# Altium schematic sheet FMC_connector.SchDoc
size A2; DocumentNumber: 3; SheetNumber: 3; SheetTotal: 30
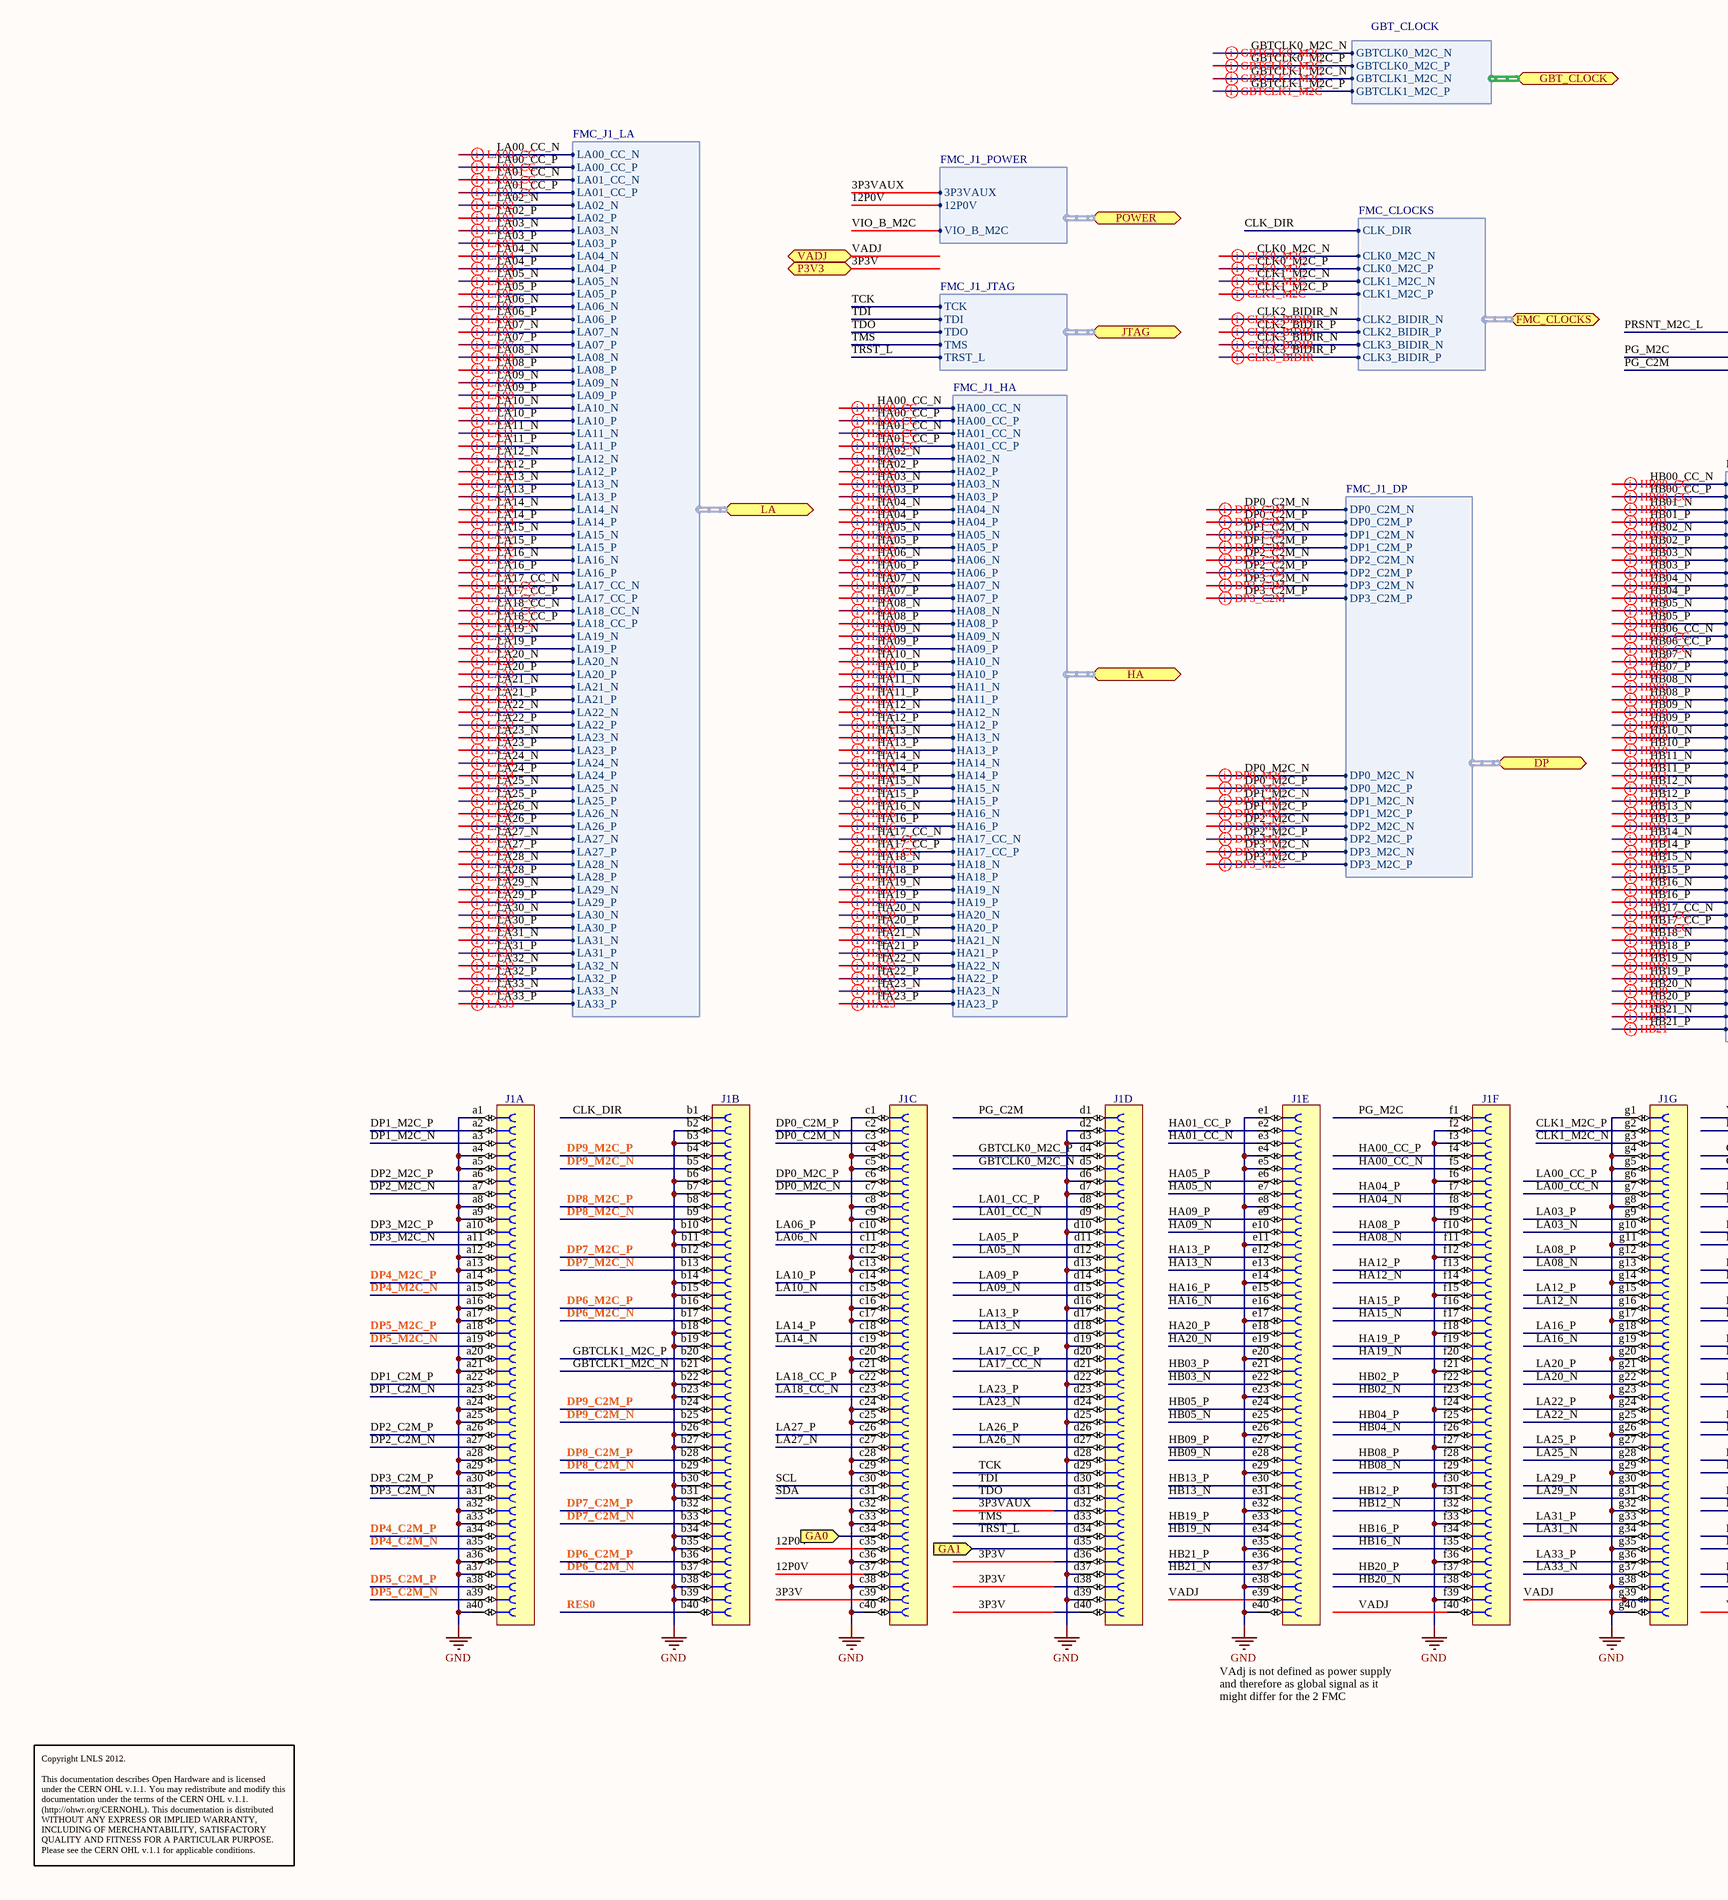
[diagram p0: FMC_connector.SchDoc, left]
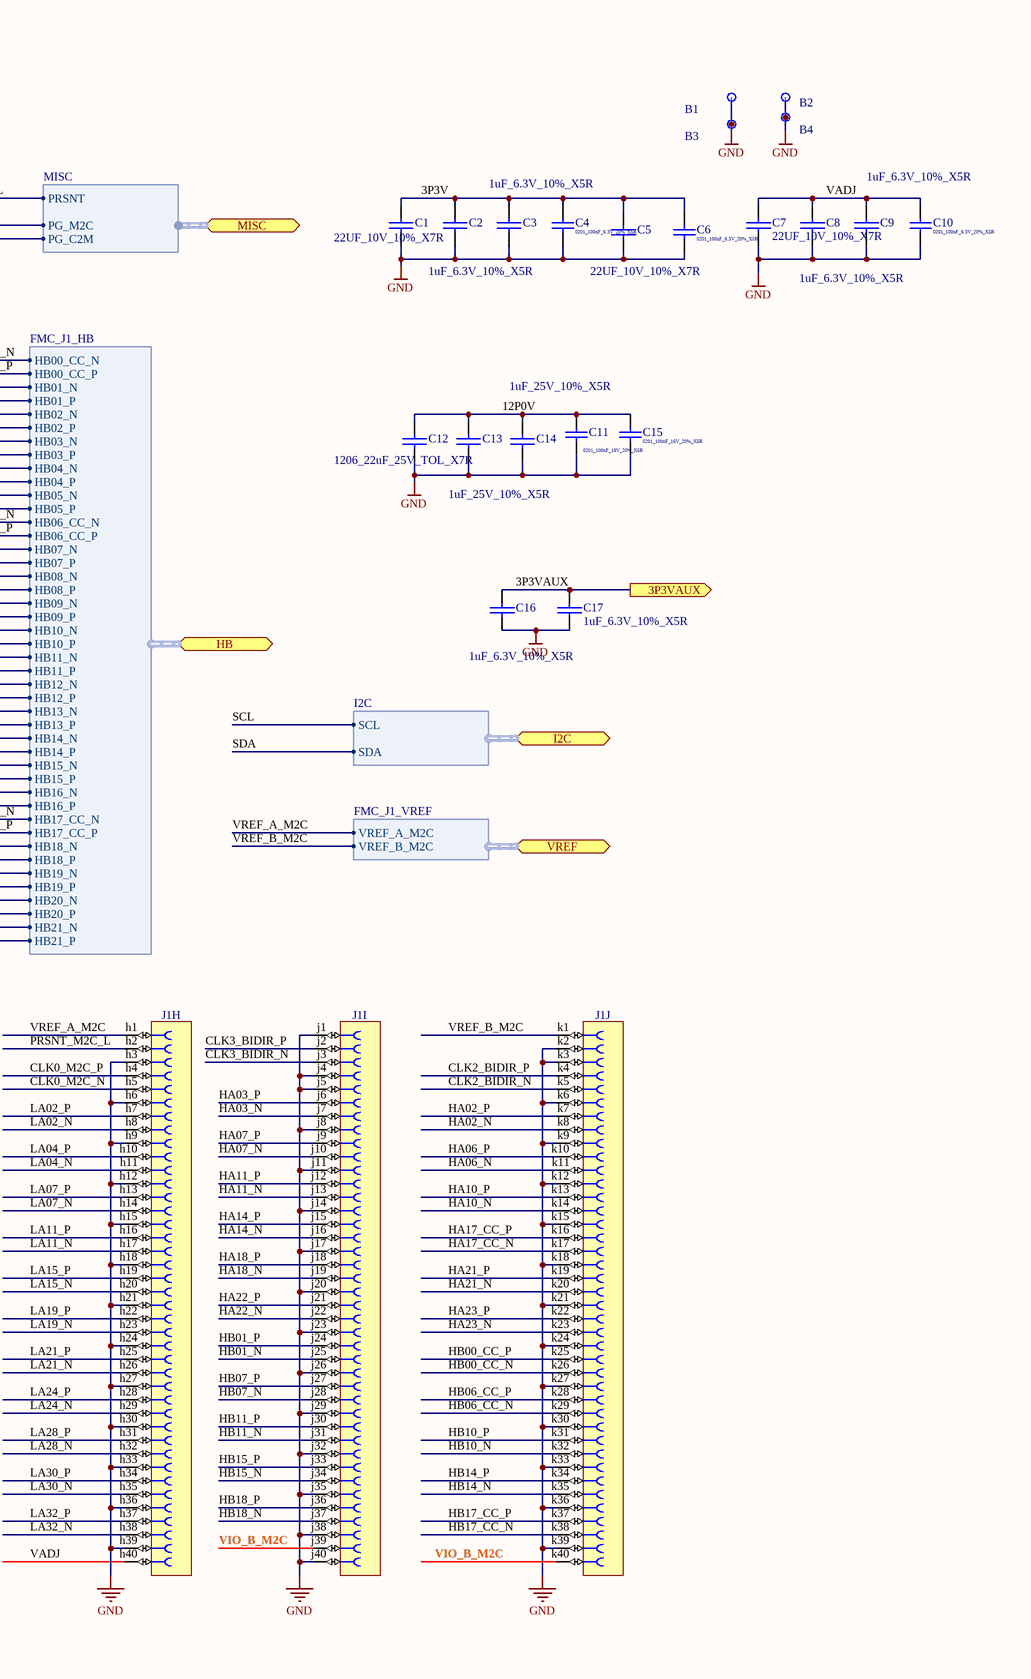
[diagram p1: FMC_connector.SchDoc, right]

## Parts
B1  Plated Hole  [MTG270_500]  (value not drawn)
B2  Plated Hole  [MTG270_500]  (value not drawn)
B3  Plated Hole  [MTG270_500]  (value not drawn)
B4  Plated Hole  [MTG270_500]  (value not drawn)
C1  22UF_10V_10%_X7R  [1206C]
C2  1uF_6.3V_10%_X5R  [0603C]
C3  1uF_6.3V_10%_X5R  [0603C]
C4  0201_100nF_6.3V_20%_X5R  [CAPC0603X33N]
C5  22UF_10V_10%_X7R  [1206C]
C6  0201_100nF_6.3V_20%_X5R  [CAPC0603X33N]
C7  22UF_10V_10%_X7R  [1206C]
C8  1uF_6.3V_10%_X5R  [0603C]
C9  1uF_6.3V_10%_X5R  [0603C]
C10  0201_100nF_6.3V_20%_X5R  [CAPC0603X33N]
C11  0201_100nF_16V_20%_X5R  [CAPC0603X33N]
C12  1206_22uF_25V_TOL_X7R  [1206C]
C13  1uF_25V_10%_X5R  [0603C]
C14  1uF_25V_10%_X5R  [0603C]
C15  0201_100nF_16V_20%_X5R  [CAPC0603X33N]
C16  1uF_6.3V_10%_X5R  [0603C]
C17  1uF_6.3V_10%_X5R  [0603C]
J1  VITA 57  [SAMTEC_ASP-134486-01]  (value not drawn)  (parts A,B,C,D,E,F,G,H,I,J of 10)

## Ports
3P3VAUX (out), DP (harness FMC_J1_DP), FMC_CLOCKS (harness FMC_CLOCKS), GA0 (in), GA1 (in), GBT_CLOCK (harness GBT_CLOCK), HA (harness FMC_J1_HA), HB (harness FMC_J1_HB), I2C (harness I2C), JTAG (harness FMC_J1_JTAG), LA (harness FMC_J1_LA), MISC (harness MISC), P3V3, POWER (harness FMC_J1_POWER), VADJ, VREF (harness FMC_J1_VREF)

## Harnesses
FMC_J1_DP: DP1_C2M_N, DP1_C2M_P, DP1_M2C_N, DP1_M2C_P, DP2_C2M_N, DP2_C2M_P, DP2_M2C_N, DP2_M2C_P, DP3_C2M_N, DP3_C2M_P, DP3_M2C_N, DP3_M2C_P, DP0_C2M_N, DP0_C2M_P, DP0_M2C_N, DP0_M2C_P
FMC_J1_LA: LA05_N, LA05_P, LA06_N, LA06_P, LA09_N, LA09_P, LA10_N, LA10_P, LA13_N, LA13_P, LA14_N, LA14_P, LA23_N, LA23_P, LA26_N, LA26_P, LA27_N, LA27_P, LA02_N, LA02_P, LA03_N, LA03_P, LA04_N, LA04_P, LA07_N, LA07_P, LA08_N, LA08_P, LA11_N, LA11_P, LA12_N, LA12_P, LA15_N, LA15_P, LA16_N, LA16_P, LA19_N, LA19_P, LA20_N, LA20_P, LA21_N, LA21_P, LA22_N, LA22_P, LA24_N, LA24_P, LA25_N, LA25_P, LA28_N, LA28_P, LA29_N, LA29_P, LA30_N, LA30_P, LA31_N, LA31_P, LA32_N, LA32_P, LA33_N, LA33_P, LA00_CC_N, LA00_CC_P, LA01_CC_N, LA01_CC_P, LA17_CC_N, LA17_CC_P, LA18_CC_N, LA18_CC_P
FMC_J1_HA: HA04_N, HA04_P, HA05_N, HA05_P, HA08_N, HA08_P, HA09_N, HA09_P, HA12_N, HA12_P, HA13_N, HA13_P, HA15_N, HA15_P, HA16_N, HA16_P, HA19_N, HA19_P, HA20_N, HA20_P, HA02_N, HA02_P, HA03_N, HA03_P, HA06_N, HA06_P, HA07_N, HA07_P, HA10_N, HA10_P, HA11_N, HA11_P, HA14_N, HA14_P, HA18_N, HA18_P, HA21_N, HA21_P, HA22_N, HA22_P, HA23_N, HA23_P, HA17_CC_N, HA17_CC_P, HA00_CC_N, HA00_CC_P, HA01_CC_N, HA01_CC_P
FMC_J1_HB: HB02_N, HB02_P, HB03_N, HB03_P, HB04_N, HB04_P, HB05_N, HB05_P, HB08_N, HB08_P, HB09_N, HB09_P, HB12_N, HB12_P, HB13_N, HB13_P, HB16_N, HB16_P, HB19_N, HB19_P, HB20_N, HB20_P, HB21_N, HB21_P, HB01_N, HB01_P, HB07_N, HB07_P, HB10_N, HB10_P, HB11_N, HB11_P, HB14_N, HB14_P, HB15_N, HB15_P, HB18_N, HB18_P, HB17_CC_N, HB17_CC_P, HB06_CC_N, HB06_CC_P, HB00_CC_N, HB00_CC_P
FMC_J1_POWER: 3P3VAUX, 12P0V, VIO_B_M2C
FMC_J1_JTAG: TCK, TDI, TDO, TMS, TRST_L
I2C: SCL, SDA
FMC_CLOCKS: CLK2_BIDIR_N, CLK2_BIDIR_P, CLK3_BIDIR_N, CLK3_BIDIR_P, CLK0_M2C_N, CLK0_M2C_P, CLK1_M2C_N, CLK1_M2C_P, CLK_DIR
FMC_J1_VREF: VREF_A_M2C, VREF_B_M2C
GBT_CLOCK: GBTCLK0_M2C_N, GBTCLK0_M2C_P, GBTCLK1_M2C_N, GBTCLK1_M2C_P
MISC: PRSNT, PG_M2C, PG_C2M

## Nets
GND: B1.1 B2.1 B3.1 B4.1 C1.2 C2.2 C3.2 C4.1 C5.2 C6.1 C7.2 C8.2 C9.2 C10.1 C11.1 C12.2 C13.2 C14.2 C15.1 C16.2 C17.2 J1.a1 J1.a4 J1.a5 J1.a8 J1.a9 J1.a12 J1.a13 J1.a16 J1.a17 J1.a20 J1.a21 J1.a24 J1.a25 J1.a28 J1.a29 J1.a32 J1.a33 J1.a36 J1.a37 J1.a40 J1.b2 J1.b3 J1.b6 J1.b7 J1.b10 J1.b11 J1.b14 J1.b15 J1.b18 J1.b19 J1.b22 J1.b23 J1.b26 J1.b27 J1.b30 J1.b31 J1.b34 J1.b35 J1.b38 J1.b39 J1.c1 J1.c4 J1.c5 J1.c8 J1.c9 J1.c12 J1.c13 J1.c16 J1.c17 J1.c20 J1.c21 J1.c24 J1.c25 J1.c28 J1.c29 J1.c32 J1.c33 J1.c36 J1.c38 J1.c40 J1.d2 J1.d3 J1.d6 J1.d7 J1.d10 J1.d13 J1.d16 J1.d19 J1.d22 J1.d25 J1.d28 J1.d37 J1.d39 J1.e1 J1.e4 J1.e5 J1.e8 J1.e11 J1.e14 J1.e17 J1.e20 J1.e23 J1.e26 J1.e29 J1.e32 J1.e35 J1.e38 J1.e40 J1.f2 J1.f3 J1.f6 J1.f9 J1.f12 J1.f15 J1.f18 J1.f21 J1.f24 J1.f27 J1.f30 J1.f33 J1.f36 J1.f39 J1.g1 J1.g4 J1.g5 J1.g8 J1.g11 J1.g14 J1.g17 J1.g20 J1.g23 J1.g26 J1.g29 J1.g32 J1.g35 J1.g38 J1.g40 J1.h3 J1.h6 J1.h9 J1.h12 J1.h15 J1.h18 J1.h21 J1.h24 J1.h27 J1.h30 J1.h33 J1.h36 J1.h39 J1.j1 J1.j4 J1.j5 J1.j8 J1.j11 J1.j14 J1.j17 J1.j20 J1.j23 J1.j26 J1.j29 J1.j32 J1.j35 J1.j38 J1.j40 J1.k2 J1.k3 J1.k6 J1.k9 J1.k12 J1.k15 J1.k18 J1.k21 J1.k24 J1.k27 J1.k30 J1.k33 J1.k36 J1.k39
3P3V: C1.1 C2.1 C3.1 C4.2 C5.1 C6.2 J1.c39 J1.d36 J1.d38 J1.d40 ; port P3V3
3P3VAUX: C16.1 C17.1 J1.d32 ; port 3P3VAUX, port POWER.3P3VAUX
12P0V: C11.2 C12.1 C13.1 C14.1 C15.2 J1.c35 J1.c37 ; port POWER.12P0V
CLK0_M2C_N: J1.h5 ; port FMC_CLOCKS.CLK0_M2C_N
CLK0_M2C_P: J1.h4 ; port FMC_CLOCKS.CLK0_M2C_P
CLK1_M2C_N: J1.g3 ; port FMC_CLOCKS.CLK1_M2C_N
CLK1_M2C_P: J1.g2 ; port FMC_CLOCKS.CLK1_M2C_P
CLK2_BIDIR_N: J1.k5 ; port FMC_CLOCKS.CLK2_BIDIR_N
CLK2_BIDIR_P: J1.k4 ; port FMC_CLOCKS.CLK2_BIDIR_P
CLK3_BIDIR_N: J1.j3 ; port FMC_CLOCKS.CLK3_BIDIR_N
CLK3_BIDIR_P: J1.j2 ; port FMC_CLOCKS.CLK3_BIDIR_P
CLK_DIR: J1.b1 ; port FMC_CLOCKS.CLK_DIR
DP0_C2M_N: J1.c3 ; port DP.DP0_C2M_N
DP0_C2M_P: J1.c2 ; port DP.DP0_C2M_P
DP0_M2C_N: J1.c7 ; port DP.DP0_M2C_N
DP0_M2C_P: J1.c6 ; port DP.DP0_M2C_P
DP1_C2M_N: J1.a23 ; port DP.DP1_C2M_N
DP1_C2M_P: J1.a22 ; port DP.DP1_C2M_P
DP1_M2C_N: J1.a3 ; port DP.DP1_M2C_N
DP1_M2C_P: J1.a2 ; port DP.DP1_M2C_P
DP2_C2M_N: J1.a27 ; port DP.DP2_C2M_N
DP2_C2M_P: J1.a26 ; port DP.DP2_C2M_P
DP2_M2C_N: J1.a7 ; port DP.DP2_M2C_N
DP2_M2C_P: J1.a6 ; port DP.DP2_M2C_P
DP3_C2M_N: J1.a31 ; port DP.DP3_C2M_N
DP3_C2M_P: J1.a30 ; port DP.DP3_C2M_P
DP3_M2C_N: J1.a11 ; port DP.DP3_M2C_N
DP3_M2C_P: J1.a10 ; port DP.DP3_M2C_P
GA0: J1.c34 ; port GA0
GA1: J1.d35 ; port GA1
GBTCLK0_M2C_N: J1.d5 ; port GBT_CLOCK.GBTCLK0_M2C_N
GBTCLK0_M2C_P: J1.d4 ; port GBT_CLOCK.GBTCLK0_M2C_P
GBTCLK1_M2C_N: J1.b21 ; port GBT_CLOCK.GBTCLK1_M2C_N
GBTCLK1_M2C_P: J1.b20 ; port GBT_CLOCK.GBTCLK1_M2C_P
HA00_CC_N: J1.f5 ; port HA.HA00_CC_N
HA00_CC_P: J1.f4 ; port HA.HA00_CC_P
HA01_CC_N: J1.e3 ; port HA.HA01_CC_N
HA01_CC_P: J1.e2 ; port HA.HA01_CC_P
HA02_N: J1.k8 ; port HA.HA02_N
HA02_P: J1.k7 ; port HA.HA02_P
HA03_N: J1.j7 ; port HA.HA03_N
HA03_P: J1.j6 ; port HA.HA03_P
HA04_N: J1.f8 ; port HA.HA04_N
HA04_P: J1.f7 ; port HA.HA04_P
HA05_N: J1.e7 ; port HA.HA05_N
HA05_P: J1.e6 ; port HA.HA05_P
HA06_N: J1.k11 ; port HA.HA06_N
HA06_P: J1.k10 ; port HA.HA06_P
HA07_N: J1.j10 ; port HA.HA07_N
HA07_P: J1.j9 ; port HA.HA07_P
HA08_N: J1.f11 ; port HA.HA08_N
HA08_P: J1.f10 ; port HA.HA08_P
HA09_N: J1.e10 ; port HA.HA09_N
HA09_P: J1.e9 ; port HA.HA09_P
HA10_N: J1.k14 ; port HA.HA10_N
HA10_P: J1.k13 ; port HA.HA10_P
HA11_N: J1.j13 ; port HA.HA11_N
HA11_P: J1.j12 ; port HA.HA11_P
HA12_N: J1.f14 ; port HA.HA12_N
HA12_P: J1.f13 ; port HA.HA12_P
HA13_N: J1.e13 ; port HA.HA13_N
HA13_P: J1.e12 ; port HA.HA13_P
HA14_N: J1.j16 ; port HA.HA14_N
HA14_P: J1.j15 ; port HA.HA14_P
HA15_N: J1.f17 ; port HA.HA15_N
HA15_P: J1.f16 ; port HA.HA15_P
HA16_N: J1.e16 ; port HA.HA16_N
HA16_P: J1.e15 ; port HA.HA16_P
HA17_CC_N: J1.k17 ; port HA.HA17_CC_N
HA17_CC_P: J1.k16 ; port HA.HA17_CC_P
HA18_N: J1.j19 ; port HA.HA18_N
HA18_P: J1.j18 ; port HA.HA18_P
HA19_N: J1.f20 ; port HA.HA19_N
HA19_P: J1.f19 ; port HA.HA19_P
HA20_N: J1.e19 ; port HA.HA20_N
HA20_P: J1.e18 ; port HA.HA20_P
HA21_N: J1.k20 ; port HA.HA21_N
HA21_P: J1.k19 ; port HA.HA21_P
HA22_N: J1.j22 ; port HA.HA22_N
HA22_P: J1.j21 ; port HA.HA22_P
HA23_N: J1.k23 ; port HA.HA23_N
HA23_P: J1.k22 ; port HA.HA23_P
HB00_CC_N: J1.k26 ; port HB.HB00_CC_N
HB00_CC_P: J1.k25 ; port HB.HB00_CC_P
HB01_N: J1.j25 ; port HB.HB01_N
HB01_P: J1.j24 ; port HB.HB01_P
HB02_N: J1.f23 ; port HB.HB02_N
HB02_P: J1.f22 ; port HB.HB02_P
HB03_N: J1.e22 ; port HB.HB03_N
HB03_P: J1.e21 ; port HB.HB03_P
HB04_N: J1.f26 ; port HB.HB04_N
HB04_P: J1.f25 ; port HB.HB04_P
HB05_N: J1.e25 ; port HB.HB05_N
HB05_P: J1.e24 ; port HB.HB05_P
HB06_CC_N: J1.k29 ; port HB.HB06_CC_N
HB06_CC_P: J1.k28 ; port HB.HB06_CC_P
HB07_N: J1.j28 ; port HB.HB07_N
HB07_P: J1.j27 ; port HB.HB07_P
HB08_N: J1.f29 ; port HB.HB08_N
HB08_P: J1.f28 ; port HB.HB08_P
HB09_N: J1.e28 ; port HB.HB09_N
HB09_P: J1.e27 ; port HB.HB09_P
HB10_N: J1.k32 ; port HB.HB10_N
HB10_P: J1.k31 ; port HB.HB10_P
HB11_N: J1.j31 ; port HB.HB11_N
HB11_P: J1.j30 ; port HB.HB11_P
HB12_N: J1.f32 ; port HB.HB12_N
HB12_P: J1.f31 ; port HB.HB12_P
HB13_N: J1.e31 ; port HB.HB13_N
HB13_P: J1.e30 ; port HB.HB13_P
HB14_N: J1.k35 ; port HB.HB14_N
HB14_P: J1.k34 ; port HB.HB14_P
HB15_N: J1.j34 ; port HB.HB15_N
HB15_P: J1.j33 ; port HB.HB15_P
HB16_N: J1.f35 ; port HB.HB16_N
HB16_P: J1.f34 ; port HB.HB16_P
HB17_CC_N: J1.k38 ; port HB.HB17_CC_N
HB17_CC_P: J1.k37 ; port HB.HB17_CC_P
HB18_N: J1.j37 ; port HB.HB18_N
HB18_P: J1.j36 ; port HB.HB18_P
HB19_N: J1.e34 ; port HB.HB19_N
HB19_P: J1.e33 ; port HB.HB19_P
HB20_N: J1.f38 ; port HB.HB20_N
HB20_P: J1.f37 ; port HB.HB20_P
HB21_N: J1.e37 ; port HB.HB21_N
HB21_P: J1.e36 ; port HB.HB21_P
LA00_CC_N: J1.g7 ; port LA.LA00_CC_N
LA00_CC_P: J1.g6 ; port LA.LA00_CC_P
LA01_CC_N: J1.d9 ; port LA.LA01_CC_N
LA01_CC_P: J1.d8 ; port LA.LA01_CC_P
LA02_N: J1.h8 ; port LA.LA02_N
LA02_P: J1.h7 ; port LA.LA02_P
LA03_N: J1.g10 ; port LA.LA03_N
LA03_P: J1.g9 ; port LA.LA03_P
LA04_N: J1.h11 ; port LA.LA04_N
LA04_P: J1.h10 ; port LA.LA04_P
LA05_N: J1.d12 ; port LA.LA05_N
LA05_P: J1.d11 ; port LA.LA05_P
LA06_N: J1.c11 ; port LA.LA06_N
LA06_P: J1.c10 ; port LA.LA06_P
LA07_N: J1.h14 ; port LA.LA07_N
LA07_P: J1.h13 ; port LA.LA07_P
LA08_N: J1.g13 ; port LA.LA08_N
LA08_P: J1.g12 ; port LA.LA08_P
LA09_N: J1.d15 ; port LA.LA09_N
LA09_P: J1.d14 ; port LA.LA09_P
LA10_N: J1.c15 ; port LA.LA10_N
LA10_P: J1.c14 ; port LA.LA10_P
LA11_N: J1.h17 ; port LA.LA11_N
LA11_P: J1.h16 ; port LA.LA11_P
LA12_N: J1.g16 ; port LA.LA12_N
LA12_P: J1.g15 ; port LA.LA12_P
LA13_N: J1.d18 ; port LA.LA13_N
LA13_P: J1.d17 ; port LA.LA13_P
LA14_N: J1.c19 ; port LA.LA14_N
LA14_P: J1.c18 ; port LA.LA14_P
LA15_N: J1.h20 ; port LA.LA15_N
LA15_P: J1.h19 ; port LA.LA15_P
LA16_N: J1.g19 ; port LA.LA16_N
LA16_P: J1.g18 ; port LA.LA16_P
LA17_CC_N: J1.d21 ; port LA.LA17_CC_N
LA17_CC_P: J1.d20 ; port LA.LA17_CC_P
LA18_CC_N: J1.c23 ; port LA.LA18_CC_N
LA18_CC_P: J1.c22 ; port LA.LA18_CC_P
LA19_N: J1.h23 ; port LA.LA19_N
LA19_P: J1.h22 ; port LA.LA19_P
LA20_N: J1.g22 ; port LA.LA20_N
LA20_P: J1.g21 ; port LA.LA20_P
LA21_N: J1.h26 ; port LA.LA21_N
LA21_P: J1.h25 ; port LA.LA21_P
LA22_N: J1.g25 ; port LA.LA22_N
LA22_P: J1.g24 ; port LA.LA22_P
LA23_N: J1.d24 ; port LA.LA23_N
LA23_P: J1.d23 ; port LA.LA23_P
LA24_N: J1.h29 ; port LA.LA24_N
LA24_P: J1.h28 ; port LA.LA24_P
LA25_N: J1.g28 ; port LA.LA25_N
LA25_P: J1.g27 ; port LA.LA25_P
LA26_N: J1.d27 ; port LA.LA26_N
LA26_P: J1.d26 ; port LA.LA26_P
LA27_N: J1.c27 ; port LA.LA27_N
LA27_P: J1.c26 ; port LA.LA27_P
LA28_N: J1.h32 ; port LA.LA28_N
LA28_P: J1.h31 ; port LA.LA28_P
LA29_N: J1.g31 ; port LA.LA29_N
LA29_P: J1.g30 ; port LA.LA29_P
LA30_N: J1.h35 ; port LA.LA30_N
LA30_P: J1.h34 ; port LA.LA30_P
LA31_N: J1.g34 ; port LA.LA31_N
LA31_P: J1.g33 ; port LA.LA31_P
LA32_N: J1.h38 ; port LA.LA32_N
LA32_P: J1.h37 ; port LA.LA32_P
LA33_N: J1.g37 ; port LA.LA33_N
LA33_P: J1.g36 ; port LA.LA33_P
PG_C2M: J1.d1 ; port MISC.PG_C2M
PG_M2C: J1.f1 ; port MISC.PG_M2C
PRSNT_M2C_L: J1.h2 ; port MISC.PRSNT
SCL: J1.c30 ; port I2C.SCL
SDA: J1.c31 ; port I2C.SDA
TCK: J1.d29 ; port JTAG.TCK
TDI: J1.d30 ; port JTAG.TDI
TDO: J1.d31 ; port JTAG.TDO
TMS: J1.d33 ; port JTAG.TMS
TRST_L: J1.d34 ; port JTAG.TRST_L
VADJ: C7.1 C8.1 C9.1 C10.2 J1.e39 J1.f40 J1.g39 J1.h40 ; port VADJ
VIO_B_M2C: port POWER.VIO_B_M2C
VREF_A_M2C: J1.h1 ; port VREF.VREF_A_M2C
VREF_B_M2C: J1.k1 ; port VREF.VREF_B_M2C

Not connected (* = marked no-connect by the designer): J1 a14 a15 a18 a19 a34 a35 a38 a39 b4 b5 b8 b9 b12 b13 b16 b17 b24 b25 b28 b29 b32 b33 b36 b37 b40 j39 k40

## Layout directives
differential pair: CLK0_M2C_N, CLK0_M2C_P, CLK1_M2C_N, CLK1_M2C_P, CLK2_BIDIR_N, CLK2_BIDIR_P, CLK3_BIDIR_N, CLK3_BIDIR_P, DP0_C2M_N, DP0_C2M_P, DP0_M2C_N, DP0_M2C_P, DP1_C2M_N, DP1_C2M_P, DP1_M2C_N, DP1_M2C_P, DP2_C2M_N, DP2_C2M_P, DP2_M2C_N, DP2_M2C_P, DP3_C2M_N, DP3_C2M_P, DP3_M2C_N, DP3_M2C_P, GBTCLK0_M2C_N, GBTCLK0_M2C_P, GBTCLK1_M2C_N, GBTCLK1_M2C_P, HA00_CC_N, HA00_CC_P, HA01_CC_N, HA01_CC_P, HA02_N, HA02_P, HA03_N, HA03_P, HA04_N, HA04_P, HA05_N, HA05_P, HA06_N, HA06_P, HA07_N, HA07_P, HA08_N, HA08_P, HA09_N, HA09_P, HA10_N, HA10_P, HA11_N, HA11_P, HA12_N, HA12_P, HA13_N, HA13_P, HA14_N, HA14_P, HA15_N, HA15_P, HA16_N, HA16_P, HA17_CC_N, HA17_CC_P, HA18_N, HA18_P, HA19_N, HA19_P, HA20_N, HA20_P, HA21_N, HA21_P, HA22_N, HA22_P, HA23_N, HA23_P, HB00_CC_N, HB00_CC_P, HB01_N, HB01_P, HB02_N, HB02_P, HB03_N, HB03_P, HB04_N, HB04_P, HB05_N, HB05_P, HB06_CC_N, HB06_CC_P, HB07_N, HB07_P, HB08_N, HB08_P, HB09_N, HB09_P, HB10_N, HB10_P, HB11_N, HB11_P, HB12_N, HB12_P, HB13_N, HB13_P, HB14_N, HB14_P, HB15_N, HB15_P, HB16_N, HB16_P, HB17_CC_N, HB17_CC_P, HB18_N, HB18_P, HB19_N, HB19_P, HB20_N, HB20_P, HB21_N, HB21_P, LA00_CC_N, LA00_CC_P, LA01_CC_N, LA01_CC_P, LA02_N, LA02_P, LA03_N, LA03_P, LA04_N, LA04_P, LA05_N, LA05_P, LA06_N, LA06_P, LA07_N, LA07_P, LA08_N, LA08_P, LA09_N, LA09_P, LA10_N, LA10_P, LA11_N, LA11_P, LA12_N, LA12_P, LA13_N, LA13_P, LA14_N, LA14_P, LA15_N, LA15_P, LA16_N, LA16_P, LA17_CC_N, LA17_CC_P, LA18_CC_N, LA18_CC_P, LA19_N, LA19_P, LA20_N, LA20_P, LA21_N, LA21_P, LA22_N, LA22_P, LA23_N, LA23_P, LA24_N, LA24_P, LA25_N, LA25_P, LA26_N, LA26_P, LA27_N, LA27_P, LA28_N, LA28_P, LA29_N, LA29_P, LA30_N, LA30_P, LA31_N, LA31_P, LA32_N, LA32_P, LA33_N, LA33_P

## Notes on the sheet
- DP8_M2C_P
- DP9_M2C_P
- DP9_M2C_N
- DP7_M2C_P
- DP7_M2C_N
- DP8_M2C_N
- DP4_M2C_P
- DP4_M2C_N
- DP5_M2C_P
- DP6_M2C_P
- DP6_M2C_N
- DP5_M2C_N
- DP8_C2M_P
- DP9_C2M_P
- DP9_C2M_N
- DP7_C2M_P
- DP7_C2M_N
- DP8_C2M_N
- DP4_C2M_P
- DP4_C2M_N
- DP5_C2M_P
- DP6_C2M_P
- DP6_C2M_N
- DP5_C2M_N
- RES0
- VIO_B_M2C
- VAdj is not defined as power supply and therefore as global signal as it might differ for the 2 FMC mezzanines.
- Copyright LNLS 2012.
  This documentation describes Open Hardware and is licensed under the CERN OHL v.1.1. You may redistribute and modify this documentation under the terms of the CERN OHL v.1.1. (http://ohwr.org/CERNOHL). This documentation is distributed WITHOUT ANY EXPRESS OR IMPLIED WARRANTY, INCLUDING OF MERCHANTABILITY, SATISFACTORY QUALITY AND FITNESS FOR A PARTICULAR PURPOSE. Please see the CERN OHL v.1.1 for applicable conditions.

## Library data of the parts
B1-B4 = PLATED_HOLE2.7_PAD5.0: Single Terminal Socket; Part Description: Plated Through Hole: Hole Dia.=2.7mm Pad Dia.=5.0mm; Mounted: No; Table: Pads; Part Number: PLATED_HOLE2.7_PAD5.0; Component Kind: Standard (No BOM); Component Type: Standard (No BOM); Pin Count: 1; Family: Plated Hole; Socket: No; SMD: No; Status: None; ComponentHeight: 0mm; Author: CERN DEM JMW; CreateDate: 2011-09-27; LatestRevisionDate: 2011-09-27; PackageDescription: Plated Through Hole: Hole Dia.=2.7mm Pad Dia.=5.0mm
C1 C5 C7 C12 = CAP_SMD_1206: Capacitor SMD; Supplier 1: Newark; Supplier Part Number 1: 90R7810
C2 C3 C8 C9 C13 C14 C16 C17 = CAP_SMD_0603: Capacitor SMD; Supplier 1: Digi-Key; Supplier Part Number 1: 490-1524-2-ND
C4 C6 C10 C11 C15 = Ceramic_0201: MiscInfo: Biggest Cern Footprint [max height]; Document Name: FMC_connector.SchDoc; Part Number: Ceramic_0201; FootprintSizeX (mm): 1.5; FootprintSizeY (mm): 0.7; FootprintRectangleArea (mm): 1.05; Thickness (Max) (mm): 0.33; FootprintAlias: 0201
J1 = SAMTEC_ASP-134486-01: Connector VITA 57, 400 Female contacts in 10 row abcdefghj; Part Description: 400 contacts (10 rows abcdefghj) Surface Mount Female Connector, VITA 57; Manufacturer: SAMTEC; Part Number: SAMTEC_ASP-134486-01; Component Kind: Standard; Component Type: Standard; Pin Count: 400; Family: VITA 57; Mounted: Yes; Socket: No; SMD: Yes; Status: None; Manufacturer Part Number: ASP-134486-01; ComponentHeight: 6.55mm; HelpURL: \\cern.ch\dfs\Applications\Altium\Datasheets\SAMTEC_ASP-134486-01.pdf; Author: CERN DEM JLC; CreateDate: 30/04/2009; LatestRevisionDate: 17/08/2009; Table: SAMTEC